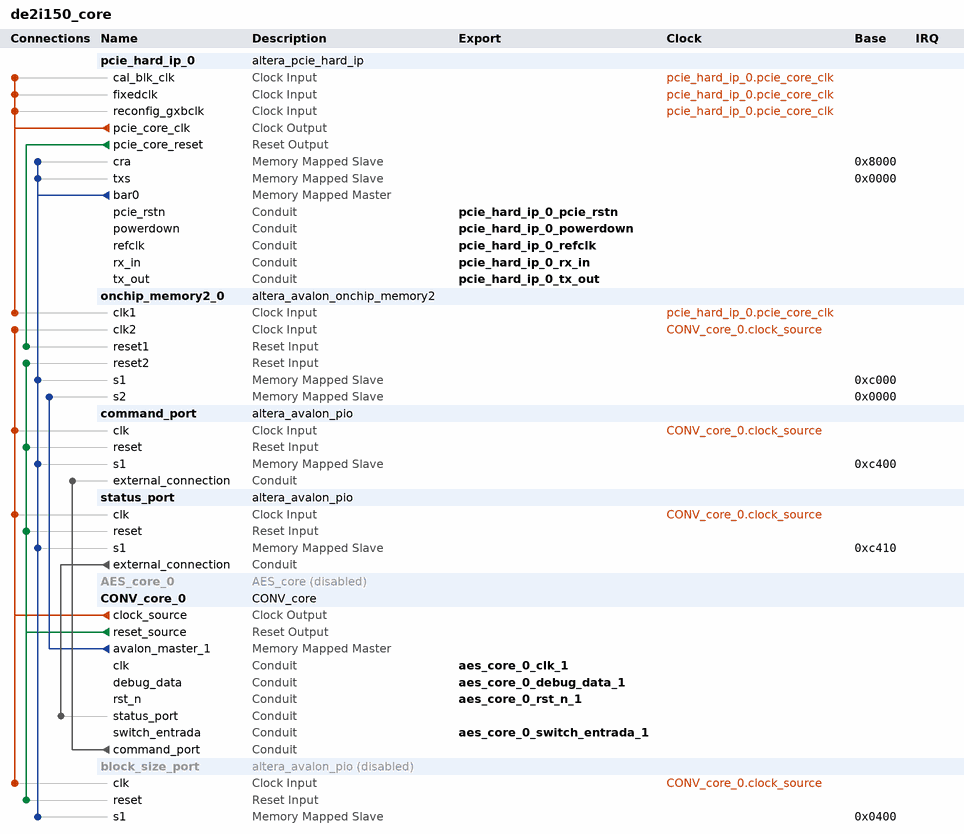
[diagram p0: system contents]
# Platform Designer (Qsys) system de2i150_core, Cyclone IV GX EP4CGX150DF31C7
# Parameters at their usual value, and those the tool derives, are not listed.
package require -exact qsys 16.1
create_system de2i150_core
set_project_property DEVICE_FAMILY {Cyclone IV GX}
set_project_property DEVICE EP4CGX150DF31C7

add_instance pcie_hard_ip_0 altera_pcie_hard_ip 16.1
set_instance_parameter_value pcie_hard_ip_0 {BAR Type} {32 bit Non-Prefetchable,Not used,Not used,Not used,Not used,Not used}
set_instance_parameter_value pcie_hard_ip_0 CB_A2P_ADDR_MAP_PASS_THRU_BITS 15
set_instance_parameter_value pcie_hard_ip_0 CG_ENABLE_A2P_INTERRUPT 0
set_instance_parameter_value pcie_hard_ip_0 CG_NO_CPL_REORDERING 0
set_instance_parameter_value pcie_hard_ip_0 {PCIe Address 31:0} 0x00000000,0x00000000,0x00000000,0x00000000,0x00000000,0x00000000,0x00000000,0x00000000,0x00000000,0x00000000,0x00000000,0x00000000,0x00000000,0x00000000,0x00000000,0x00000000
set_instance_parameter_value pcie_hard_ip_0 {PCIe Address 63:32} 0x00000000,0x00000000,0x00000000,0x00000000,0x00000000,0x00000000,0x00000000,0x00000000,0x00000000,0x00000000,0x00000000,0x00000000,0x00000000,0x00000000,0x00000000,0x00000000
set_instance_parameter_value pcie_hard_ip_0 class_code 0
set_instance_parameter_value pcie_hard_ip_0 device_id 4
set_instance_parameter_value pcie_hard_ip_0 my_advanced_errors false
set_instance_parameter_value pcie_hard_ip_0 my_enable_ecrc_check false
set_instance_parameter_value pcie_hard_ip_0 my_enable_ecrc_gen false
set_instance_parameter_value pcie_hard_ip_0 p_pcie_test_out_width None
set_instance_parameter_value pcie_hard_ip_0 p_user_msi_enable 0
set_instance_parameter_value pcie_hard_ip_0 subsystem_device_id 4
set_instance_parameter_value pcie_hard_ip_0 subsystem_vendor_id 4466
set_instance_parameter_value pcie_hard_ip_0 vendor_id 4466

add_instance onchip_memory2_0 altera_avalon_onchip_memory2 16.1
set_instance_parameter_value onchip_memory2_0 dataWidth 32
set_instance_parameter_value onchip_memory2_0 dualPort true
set_instance_parameter_value onchip_memory2_0 initMemContent true
set_instance_parameter_value onchip_memory2_0 initializationFileName /home/moein/Desktop/de2i150/AES/hw/onchip_memory2_0.hex
set_instance_parameter_value onchip_memory2_0 memorySize 1024

add_instance command_port altera_avalon_pio 16.1
set_instance_parameter_value command_port direction Output
set_instance_parameter_value command_port width 32

add_instance status_port altera_avalon_pio 16.1
set_instance_parameter_value status_port direction Input
set_instance_parameter_value status_port width 32

add_instance AES_core_0 AES_core 1.0
set_instance_property AES_core_0 ENABLED false

add_instance CONV_core_0 CONV_core 1.0

add_instance block_size_port altera_avalon_pio 16.1
set_instance_property block_size_port ENABLED false
set_instance_parameter_value block_size_port direction Output
set_instance_parameter_value block_size_port width 32

# connections
add_connection CONV_core_0.clock_source block_size_port.clk clock
add_connection CONV_core_0.clock_source command_port.clk clock
add_connection CONV_core_0.clock_source onchip_memory2_0.clk2 clock
add_connection CONV_core_0.clock_source status_port.clk clock
add_connection pcie_hard_ip_0.pcie_core_clk onchip_memory2_0.clk1 clock
add_connection pcie_hard_ip_0.pcie_core_clk pcie_hard_ip_0.cal_blk_clk clock
add_connection pcie_hard_ip_0.pcie_core_clk pcie_hard_ip_0.fixedclk clock
add_connection pcie_hard_ip_0.pcie_core_clk pcie_hard_ip_0.reconfig_gxbclk clock
add_connection CONV_core_0.reset_source block_size_port.reset reset
add_connection CONV_core_0.reset_source command_port.reset reset
add_connection CONV_core_0.reset_source onchip_memory2_0.reset2 reset
add_connection CONV_core_0.reset_source status_port.reset reset
add_connection pcie_hard_ip_0.pcie_core_reset onchip_memory2_0.reset1 reset
add_connection CONV_core_0.avalon_master_1 onchip_memory2_0.s2 avalon
set_connection_parameter_value CONV_core_0.avalon_master_1/onchip_memory2_0.s2 baseAddress 0x0000
add_connection pcie_hard_ip_0.bar0 block_size_port.s1 avalon
set_connection_parameter_value pcie_hard_ip_0.bar0/block_size_port.s1 baseAddress 0x0400
add_connection pcie_hard_ip_0.bar0 command_port.s1 avalon
set_connection_parameter_value pcie_hard_ip_0.bar0/command_port.s1 baseAddress 0xc400
add_connection pcie_hard_ip_0.bar0 onchip_memory2_0.s1 avalon
set_connection_parameter_value pcie_hard_ip_0.bar0/onchip_memory2_0.s1 baseAddress 0xc000
add_connection pcie_hard_ip_0.bar0 pcie_hard_ip_0.cra avalon
set_connection_parameter_value pcie_hard_ip_0.bar0/pcie_hard_ip_0.cra baseAddress 0x8000
add_connection pcie_hard_ip_0.bar0 pcie_hard_ip_0.txs avalon
set_connection_parameter_value pcie_hard_ip_0.bar0/pcie_hard_ip_0.txs baseAddress 0x0000
add_connection pcie_hard_ip_0.bar0 status_port.s1 avalon
set_connection_parameter_value pcie_hard_ip_0.bar0/status_port.s1 baseAddress 0xc410
add_connection CONV_core_0.command_port command_port.external_connection conduit
add_connection status_port.external_connection CONV_core_0.status_port conduit

# exported interfaces
add_interface aes_core_0_clk_1 conduit end
set_interface_property aes_core_0_clk_1 EXPORT_OF CONV_core_0.clk
add_interface aes_core_0_debug_data_1 conduit end
set_interface_property aes_core_0_debug_data_1 EXPORT_OF CONV_core_0.debug_data
add_interface aes_core_0_rst_n_1 conduit end
set_interface_property aes_core_0_rst_n_1 EXPORT_OF CONV_core_0.rst_n
add_interface aes_core_0_switch_entrada_1 conduit end
set_interface_property aes_core_0_switch_entrada_1 EXPORT_OF CONV_core_0.switch_entrada
add_interface pcie_hard_ip_0_pcie_rstn conduit end
set_interface_property pcie_hard_ip_0_pcie_rstn EXPORT_OF pcie_hard_ip_0.pcie_rstn
add_interface pcie_hard_ip_0_powerdown conduit end
set_interface_property pcie_hard_ip_0_powerdown EXPORT_OF pcie_hard_ip_0.powerdown
add_interface pcie_hard_ip_0_refclk conduit end
set_interface_property pcie_hard_ip_0_refclk EXPORT_OF pcie_hard_ip_0.refclk
add_interface pcie_hard_ip_0_rx_in conduit end
set_interface_property pcie_hard_ip_0_rx_in EXPORT_OF pcie_hard_ip_0.rx_in
add_interface pcie_hard_ip_0_tx_out conduit end
set_interface_property pcie_hard_ip_0_tx_out EXPORT_OF pcie_hard_ip_0.tx_out

set_interconnect_requirement {$system} qsys_mm.clockCrossingAdapter HANDSHAKE
set_interconnect_requirement {$system} qsys_mm.maxAdditionalLatency 1

save_system de2i150_core.qsys
